# Altium schematic sheet MCU.SchDoc
size A4
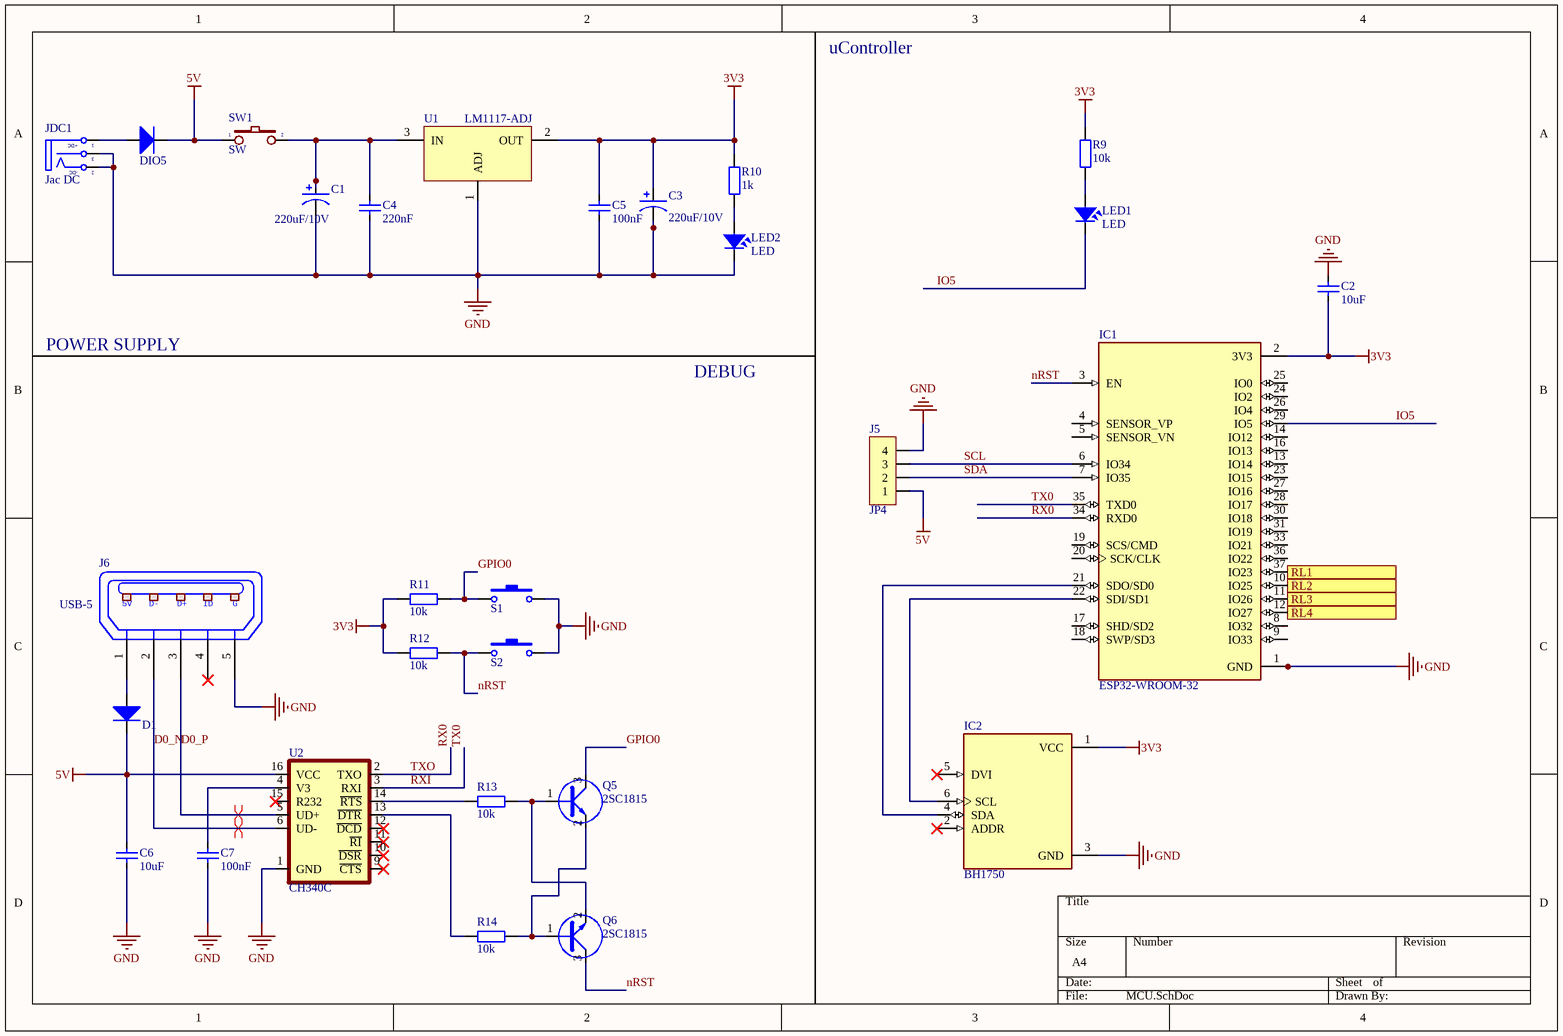
[diagram p0: MCU.SchDoc]

## Parts
C1  220uF/10V  [C5mm]
C2  10uF  [CAP_0805]
C3  220uF/10V  [C5mm]
C4  220nF  [CAP_0805]
C5  100nF  [CAP_0805]
C6  10uF  [CAP_0805]
C7  100nF  [CAP_0805]
D1  Diode SMD  [DIO-214AC(SMA)]  (value not drawn)
DIO5  Diode SMD  [DIO-214AC(SMA)]  (value not drawn)
IC1  ESP32-WROOM-32  [MODULE_ESP32-WROOM-32]
IC2  BH1750  [BH1750]
J5  JP4  [JP4-C1T]
J6  USB-5  [USB-M1]
JDC1  Jac DC  [DC-IN]
LED1  LED  [LED-0805-Orange]
LED2  LED  [LED-0805-Red]
Q5  2SC1815  [SOT23D]
Q6  2SC1815  [SOT23D]
R9  10k  [RES-SMD-0805]
R10  1k  [RES-SMD-0805]
R11  10k  [RES-SMD-0805]
R12  10k  [RES-SMD-0805]
R13  10k  [RES-SMD-0805]
R14  10k  [RES-SMD-0805]
S1  SW-SMD  [SW 3x2x4]  (value not drawn)
S2  SW-SMD  [SW 3x2x4]  (value not drawn)
SW1  SW  [SW2]
U1  LM1117-ADJ  [LM1117-SOP]
U2  CH340C  [SOP-16]

## Ports
RL1, RL2, RL3, RL4

## Nets
3V3: C2.2 C3.1 C5.2 IC1.2(3V3) IC2.1(VCC) R9.1 R10.1 R11.2 R12.2 U1.2(OUT)
5V: C6.2 D1.2(K) DIO5.2(K) J5.1 SW1.1 U2.16(VCC)
GND: C1.2 C2.1 C3.2 C4.1 C5.1 C6.1 C7.1 IC1.1(GND) IC1.15(GND) IC1.38(GND) IC1.39_1(GND) IC1.39_2(GND) IC1.39_3(GND) IC1.39_4(GND) IC1.39_5(GND) IC1.39_6(GND) IC1.39_7(GND) IC1.39_8(GND) IC1.39_9(GND) IC1.39_10(GND) IC1.39_11(GND) IC1.39_12(GND) IC1.39_13(GND) IC1.39_14(GND) IC1.39_15(GND) IC1.39_16(GND) IC1.39_17(GND) IC1.39_18(GND) IC1.39_19(GND) IC1.39_20(GND) IC1.39_21(GND) IC2.3(GND) J5.4 J6.5(P5) JDC1.2(TN) JDC1.3(S) LED2.2 S1.2 S2.2 U1.1(ADJ) U2.1(GND)
D0_N: J6.2(P2) U2.6(UD-)
D0_P: J6.3(P3) U2.5(UD+)
GPIO0: Q5.3(C) R11.1 S1.1
IO5: IC1.29(IO5) LED1.2
nRST: IC1.3(EN) Q6.3(C) R12.1 S2.1
RL1: IC1.37(IO23) ; port RL1
RL2: IC1.10(IO25) ; port RL2
RL3: IC1.11(IO26) ; port RL3
RL4: IC1.12(IO27) ; port RL4
RX0: IC1.34(RXD0) U2.2(TXO)  [also labelled TXO]
RXI: IC1.35(TXD0) U2.3(RXI)  [also labelled TX0]
SCL: IC1.6(IO34) J5.3
SDA: IC1.7(IO35) J5.2
NetC1_1: C1.1 C4.2 SW1.2 U1.3(IN)
NetC7_2: C7.2 U2.4(V3)
NetD1_1: D1.1(A) J6.1(P1)
NetDIO5_1: DIO5.1(A) JDC1.1(T)
NetIC1_21: IC1.21(SDO/SD0) IC2.4(SDA)
NetIC1_22: IC1.22(SDI/SD1) IC2.6(SCL)
NetLED1_1: LED1.1 R9.2
NetLED2_1: LED2.1 R10.2
NetQ5_1: Q5.1(B) Q6.2(E) R13.1
NetQ5_2: Q5.2(E) Q6.1(B) R14.1
NetR13_2: R13.2 U2.14(~{RTS})
NetR14_2: R14.2 U2.13(~{DTR})

Not connected (* = marked no-connect by the designer): IC1 4(SENSOR_VP) 5(SENSOR_VN) 8(IO32) 9(IO33) 13(IO14) 14(IO12) 16(IO13) 17(SHD/SD2) 18(SWP/SD3) 19(SCS/CMD) 20(SCK/CLK) 23(IO15) 24(IO2) 25(IO0) 26(IO4) 27(IO16) 28(IO17) 30(IO18) 31(IO19) 33(IO21) 36(IO22); IC2 2(ADDR)* 5(DVI)*; J6 4(P4)*; U2 9(~{CTS})* 10(~{DSR})* 11(~{RI})* 12(~{DCD})* 15(R232)*

## Layout directives
differential pair: D0_N, D0_P

## Notes on the sheet
- uController
- POWER SUPPLY
- DEBUG
- (in symbol DCIN) +DC; -DC
- (in symbol USB-5) 5V; D-; D+; ID; G

## Library data of the parts
C1 C3 = Cap Pol: Polarized Capacitor (Axial); Published: 8-Jun-2000; LatestRevisionDate: 17-Jul-2002; LatestRevisionNote: Re-released for DXP Platform.; PackageReference: POLAR0.8; Publisher: Altium Limited
C2 C4-C7 = CapSMD: Capacitor; Value: 33p; Published: 8-Jun-2000; LatestRevisionDate: 17-Jul-2002; LatestRevisionNote: Re-released for DXP Platform.; PackageReference: RAD-0.3; Publisher: Altium Limited
D1 DIO5 = Diode SMD: Default Diode; Code - JEDEC: DO-214-AB; Value: 1N5007; Published: 8-Jun-2000; Revision: July-2002: Re-released for DXP Platform.; Publisher: Altium Limited
IC1 = ESP32-WROOM-32: Bluetooth, WiFi Transceiver Module 2.4GHz ~ 2.5GHz Surface Mount; MF: Espressif Systems; Package: Module Espressif Systems; Digi-Key_Part_Number: 1904-1010-1-ND; Digi-Key_Purchase_URL: https://www.digikey.com/product-detail/en/espressif-systems/ESP32-WROOM-32/1904-1010-1-ND/8544305?utm_source=snapeda&utm_medium=aggregator&utm_campaign=symbol; Value: *; MP: ESP32-WROOM-32; SnapEDA_Link: https://www.snapeda.com/parts/ESP32-WROOM-32/Espressif%20Systems/view-part/2753322/?ref=snap
J5 = JP4: WR-PHD 2.54 mm Angled Socket Header; Manufacturer: W¨¹rth Elektronik eiSos GmbH; partNo: 613004143121; ComponentLink1 Description: Manufacturer; ComponentLink2 Description: Datasheet; NoPins: 04; Created Date: 29 March 2013; ComponentLink1URL: http://www.we-online.com; ComponentLink2URL: http://katalog.we-online.de/em/datasheet/6130xx143121.pdf; Created by: Karrer Zheng
J6 = USB-5: Manufacturer: FCI; Manufacturer Part Number: 10118193-0001LF; Connector Type: USB - micro B; Number of Contacts: 5; Gender: Receptacle; Specifications: USB 2.0; .Creator: MM; .Checked PCB: RF; Supplier 1: Digi-Key; RoHS: RoHS Compliant; Category: Connectors, Interconnects; Stock 1: 28642; Pricing 1: 1=0.46, 10=0.433, 25=0.3712, 50=0.3156, 100=0.3032, 250=0.27224, 500=0.25988 (USD); Packaging: Cut Tape (CT); Mounting Type: Surface Mount, Right Angle, Horizontal; Features: Shielded, Solder Retention; Ingress Protection: -; ComponentLink1URL: http://portal.fciconnect.com/Comergent//fci/drawing/10118193.pdf; ComponentLink1Description: http://portal.fciconnect.com/Comergent//fci/drawing/10118193.pdf; Supplier Part Number 1: 609-4616-1-ND; .Checked SCH: MM
JDC1 = DCIN: Jac DC input; Value: Jac DC
LED1 LED2 = LED: LED Single colour Green and Red; Value: LED 3 ly Single Colour
Q5 Q6 = C1815: NPN 600mW, ECB; Value: C1815
R9-R14 = Resistor - SMD: Resistor SMD; Manufacturer: Generic Components; Class: Passive; Published: 08/06/2000; Publisher: Altium Hobart Technology Centre
S1 S2 = SW-SMD: Switch; Published: 24-Mar-1999; LatestRevisionDate: 17-Jul-2002; LatestRevisionNote: Re-released for DXP Platform.; PackageReference: SPST-2; Publisher: Altium Limited
SW1 = SW2: Switch button 2 pin; Value: SW chip 2 pin
U1 = LM1117-ADJ: 800mA Low-Dropout Linear Regulator; Creator: Nguyen Ba Bien; Website: http://group3i.net
U2 = CH340C: USB to serial chip CH340; MF: WCH; Package: Package; Check_prices: https://www.snapeda.com/parts/CH340C/WCH/view-part/5428851/?ref=eda; Value: *; Price: None; MP: CH340C; Availability: Unavailable; SnapEDA_Link: https://www.snapeda.com/parts/CH340C/WCH/view-part/5428851/?ref=snap